# EAGLE design Daisy_Test (EAGLE 9.7.0)
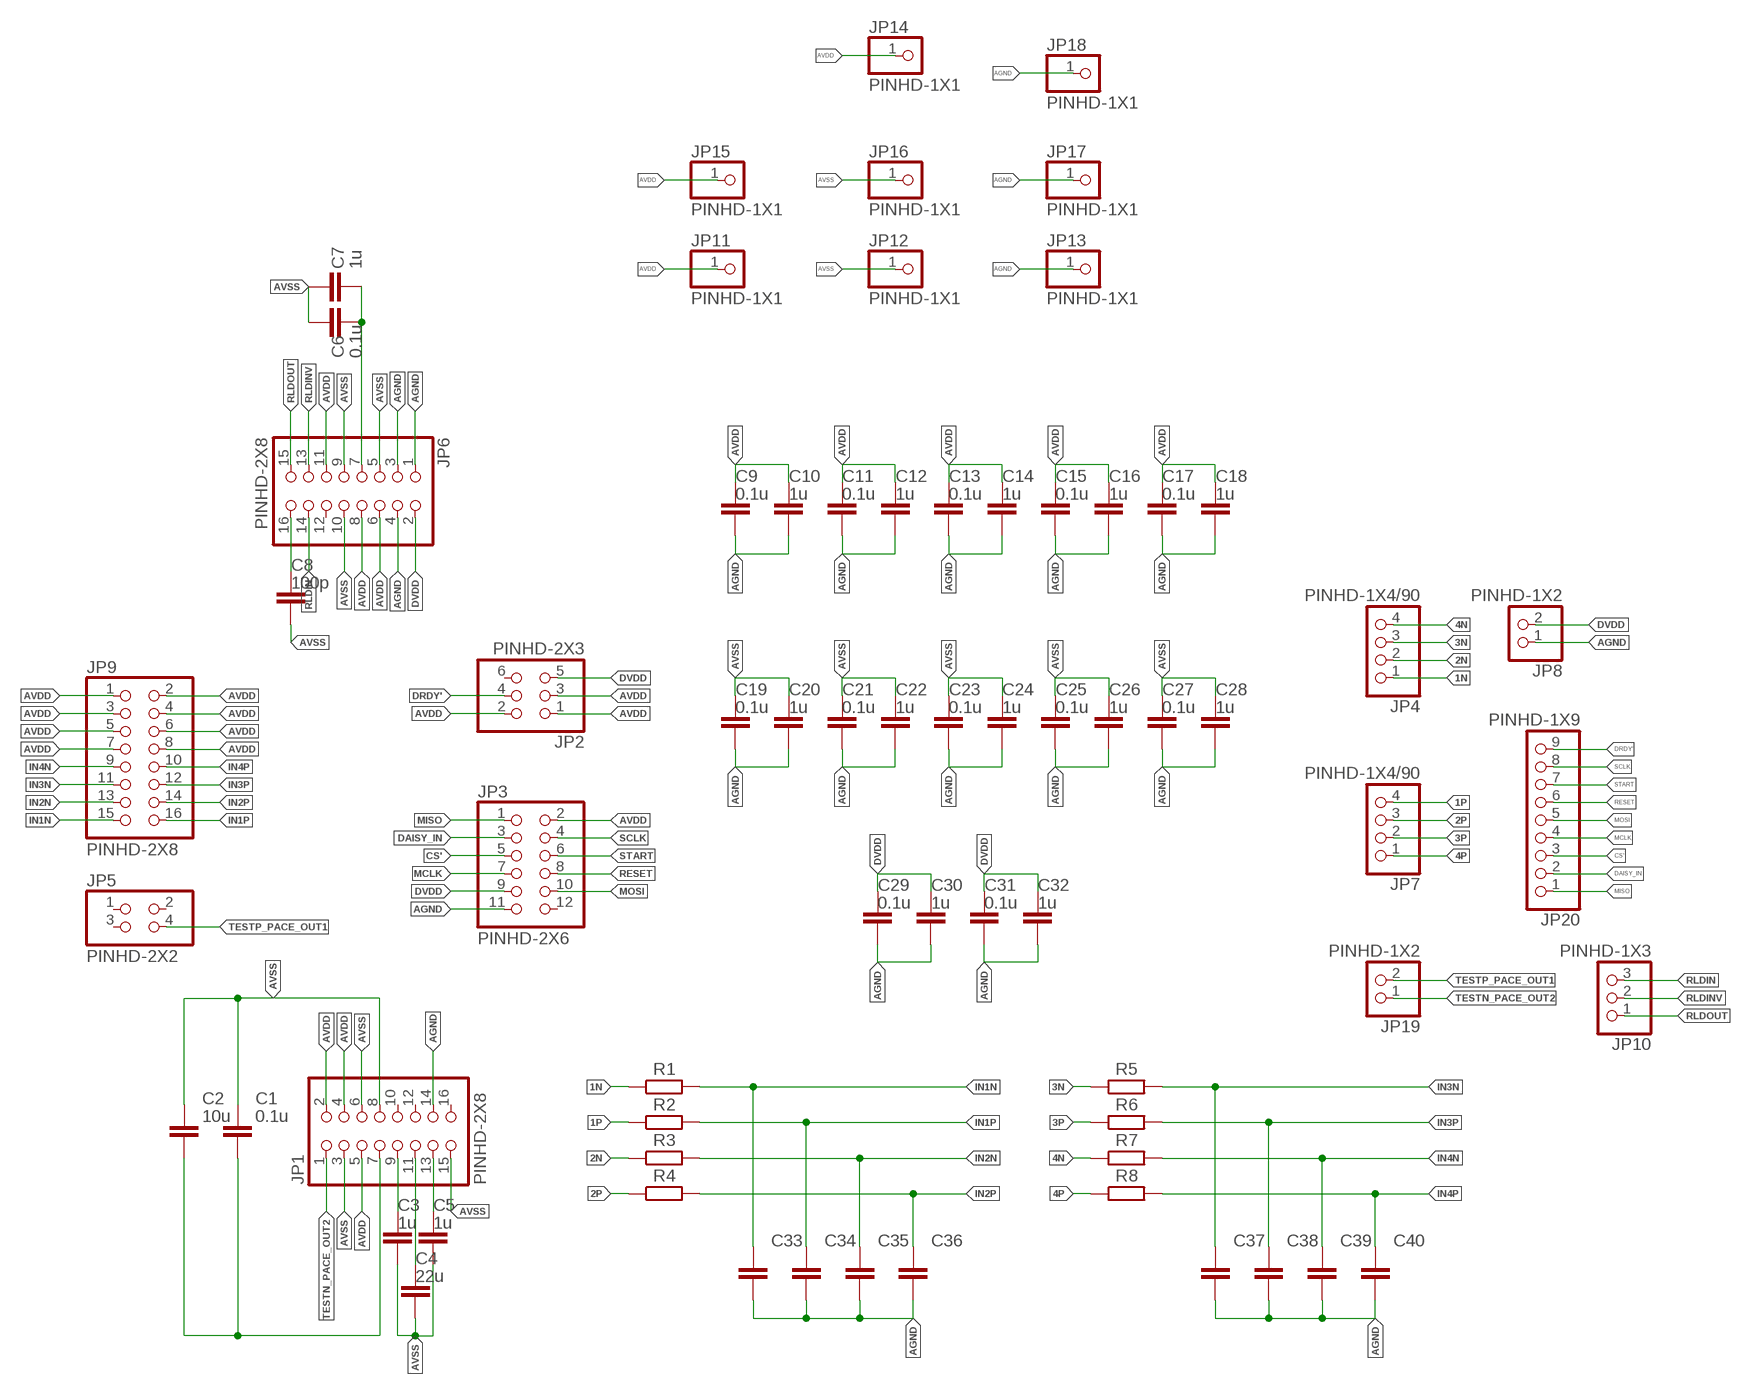
[diagram p0: schematic, sheet 1]

## Parts
C1  0.1u  C_CHIP-0805(2012-METRIC)  [CAPC2012X110]
C2  10u  C_CHIP-0805(2012-METRIC)  [CAPC2012X110]
C3  1u  C_CHIP-0805(2012-METRIC)  [CAPC2012X110]
C4  22u  C_CHIP-0805(2012-METRIC)  [CAPC2012X110]
C5  1u  C_CHIP-0805(2012-METRIC)  [CAPC2012X110]
C6  0.1u  C_CHIP-0805(2012-METRIC)  [CAPC2012X110]
C7  1u  C_CHIP-0805(2012-METRIC)  [CAPC2012X110]
C8  100p  C_CHIP-0805(2012-METRIC)  [CAPC2012X110]
C9  0.1u  C_CHIP-0805(2012-METRIC)  [CAPC2012X110]
C10  1u  C_CHIP-0805(2012-METRIC)  [CAPC2012X110]
C11  0.1u  C_CHIP-0805(2012-METRIC)  [CAPC2012X110]
C12  1u  C_CHIP-0805(2012-METRIC)  [CAPC2012X110]
C13  0.1u  C_CHIP-0805(2012-METRIC)  [CAPC2012X110]
C14  1u  C_CHIP-0805(2012-METRIC)  [CAPC2012X110]
C15  0.1u  C_CHIP-0805(2012-METRIC)  [CAPC2012X110]
C16  1u  C_CHIP-0805(2012-METRIC)  [CAPC2012X110]
C17  0.1u  C_CHIP-0805(2012-METRIC)  [CAPC2012X110]
C18  1u  C_CHIP-0805(2012-METRIC)  [CAPC2012X110]
C19  0.1u  C_CHIP-0805(2012-METRIC)  [CAPC2012X110]
C20  1u  C_CHIP-0805(2012-METRIC)  [CAPC2012X110]
C21  0.1u  C_CHIP-0805(2012-METRIC)  [CAPC2012X110]
C22  1u  C_CHIP-0805(2012-METRIC)  [CAPC2012X110]
C23  0.1u  C_CHIP-0805(2012-METRIC)  [CAPC2012X110]
C24  1u  C_CHIP-0805(2012-METRIC)  [CAPC2012X110]
C25  0.1u  C_CHIP-0805(2012-METRIC)  [CAPC2012X110]
C26  1u  C_CHIP-0805(2012-METRIC)  [CAPC2012X110]
C27  0.1u  C_CHIP-0805(2012-METRIC)  [CAPC2012X110]
C28  1u  C_CHIP-0805(2012-METRIC)  [CAPC2012X110]
C29  0.1u  C_CHIP-0805(2012-METRIC)  [CAPC2012X110]
C30  1u  C_CHIP-0805(2012-METRIC)  [CAPC2012X110]
C31  0.1u  C_CHIP-0805(2012-METRIC)  [CAPC2012X110]
C32  1u  C_CHIP-0805(2012-METRIC)  [CAPC2012X110]
C33  C_CHIP-0805(2012-METRIC)  [CAPC2012X110]
C34  C_CHIP-0805(2012-METRIC)  [CAPC2012X110]
C35  C_CHIP-0805(2012-METRIC)  [CAPC2012X110]
C36  C_CHIP-0805(2012-METRIC)  [CAPC2012X110]
C37  C_CHIP-0805(2012-METRIC)  [CAPC2012X110]
C38  C_CHIP-0805(2012-METRIC)  [CAPC2012X110]
C39  C_CHIP-0805(2012-METRIC)  [CAPC2012X110]
C40  C_CHIP-0805(2012-METRIC)  [CAPC2012X110]
JP1  PINHD-2X8  [2X08]
JP2  PINHD-2X3  [2X03]
JP3  PINHD-2X6  [2X06]
JP4  PINHD-1X4/90  [1X04/90]
JP5  PINHD-2X2  [2X02]
JP6  PINHD-2X8  [2X08]
JP7  PINHD-1X4/90  [1X04/90]
JP8  PINHD-1X2  [1X02]
JP9  PINHD-2X8  [2X08]
JP10  PINHD-1X3  [1X03]
JP11  PINHD-1X1  [1X01]
JP12  PINHD-1X1  [1X01]
JP13  PINHD-1X1  [1X01]
JP14  PINHD-1X1  [1X01]
JP15  PINHD-1X1  [1X01]
JP16  PINHD-1X1  [1X01]
JP17  PINHD-1X1  [1X01]
JP18  PINHD-1X1  [1X01]
JP19  PINHD-1X2  [1X02]
JP20  PINHD-1X9  [1X09]
R1  R_CHIP-1206(3216-METRIC)  [RESC3216X70]
R2  R_CHIP-1206(3216-METRIC)  [RESC3216X70]
R3  R_CHIP-1206(3216-METRIC)  [RESC3216X70]
R4  R_CHIP-1206(3216-METRIC)  [RESC3216X70]
R5  R_CHIP-1206(3216-METRIC)  [RESC3216X70]
R6  R_CHIP-1206(3216-METRIC)  [RESC3216X70]
R7  R_CHIP-1206(3216-METRIC)  [RESC3216X70]
R8  R_CHIP-1206(3216-METRIC)  [RESC3216X70]

## Nets
1N: JP4.1 R1.1
1P: JP7.4 R2.1
2N: JP4.2 R3.1
2P: JP7.3 R4.1
3N: JP4.3 R5.1
3P: JP7.2 R6.1
4N: JP4.4 R7.1
4P: JP7.1 R8.1
AGND: C9.2 C10.2 C11.2 C12.2 C13.2 C14.2 C15.2 C16.2 C17.2 C18.2 C19.2 C20.2 C21.2 C22.2 C23.2 C24.2 C25.2 C26.2 C27.2 C28.2 C29.2 C30.2 C31.2 C32.2 C33.2 C34.2 C35.2 C36.2 C37.2 C38.2 C39.2 C40.2 JP1.14 JP3.11 JP6.1 JP6.3 JP6.4 JP8.1 JP13.1 JP17.1 JP18.1
AVDD: C9.1 C10.1 C11.1 C12.1 C13.1 C14.1 C15.1 C16.1 C17.1 C18.1 JP1.2 JP1.4 JP1.5 JP2.1 JP2.2 JP2.3 JP3.2 JP6.6 JP6.8 JP6.11 JP9.1 JP9.2 JP9.3 JP9.4 JP9.5 JP9.6 JP9.7 JP9.8 JP11.1 JP14.1 JP15.1
AVSS: C1.1 C2.1 C3.2 C4.2 C5.2 C6.1 C7.1 C8.2 C19.1 C20.1 C21.1 C22.1 C23.1 C24.1 C25.1 C26.1 C27.1 C28.1 JP1.3 JP1.6 JP1.8 JP1.15 JP6.5 JP6.9 JP6.10 JP12.1 JP16.1
CS': JP3.5 JP20.3
DAISY_IN: JP3.3 JP20.2
DRDY': JP2.4 JP20.9
DVDD: C29.1 C30.1 C31.1 C32.1 JP2.5 JP3.9 JP6.2 JP8.2
IN1N: C33.1 JP9.15 R1.2
IN1P: C34.1 JP9.16 R2.2
IN2N: C35.1 JP9.13 R3.2
IN2P: C36.1 JP9.14 R4.2
IN3N: C37.1 JP9.11 R5.2
IN3P: C38.1 JP9.12 R6.2
IN4N: C39.1 JP9.9 R7.2
IN4P: C40.1 JP9.10 R8.2
MCLK: JP3.7 JP20.4
MISO: JP3.1 JP20.1
MOSI: JP3.10 JP20.5
N$1: C3.1 JP1.9
N$3: C4.1 JP1.11
N$4: C5.1 JP1.13
N$5: C6.2 C7.2 JP6.7
N$6: C8.1 JP6.16
N$7: C1.2 C2.2 JP1.7
RESET: JP3.8 JP20.6
RLDIN: JP6.14 JP10.3
RLDINV: JP6.13 JP10.2
RLDOUT: JP6.15 JP10.1
SCLK: JP3.4 JP20.8
START: JP3.6 JP20.7
TESTN_PACE_OUT2: JP1.1 JP19.1
TESTP_PACE_OUT1: JP5.4 JP19.2
Unconnected: JP1.10 JP1.12 JP1.16 JP2.6 JP3.12 JP5.1 JP5.2 JP5.3 JP6.12

## Library data of the parts
C1-C40 = Capacitor:C: Capacitor - Generic; CATEGORY: Capacitor
JP1 JP6 JP9 = Connector:PINHD-2X8: PIN HEADER; CATEGORY: CONNECTOR; SUB-CATEGORY: PIN-HEADER
JP2 = Connector:PINHD-2X3: PIN HEADER; CATEGORY: CONNECTOR; SUB-CATEGORY: PIN-HEADER
JP3 = Connector:PINHD-2X6: PIN HEADER; CATEGORY: CONNECTOR; SUB-CATEGORY: PIN-HEADER
JP4 JP7 = Connector:PINHD-1X4: PIN HEADER; CATEGORY: CONNECTOR; SUB-CATEGORY: PIN-HEADER
JP5 = Connector:PINHD-2X2: PIN HEADER; CATEGORY: CONNECTOR; SUB-CATEGORY: PIN-HEADER
JP8 JP19 = Connector:PINHD-1X2: PIN HEADER; CATEGORY: CONNECTOR; SUB-CATEGORY: PIN-HEADER
JP10 = Connector:PINHD-1X3: PIN HEADER; CATEGORY: CONNECTOR; SUB-CATEGORY: PIN-HEADER
JP11-JP18 = Connector:PINHD-1X1: PIN HEADER; CATEGORY: CONNECTOR; SUB-CATEGORY: PIN-HEADER
JP20 = Connector:PINHD-1X9: PIN HEADER; CATEGORY: CONNECTOR; SUB-CATEGORY: PIN-HEADER
R1-R8 = Resistor:R: Resistor Fixed - Generic; CATEGORY: Resistor; SUB-CATEGORY: Fixed

## Board
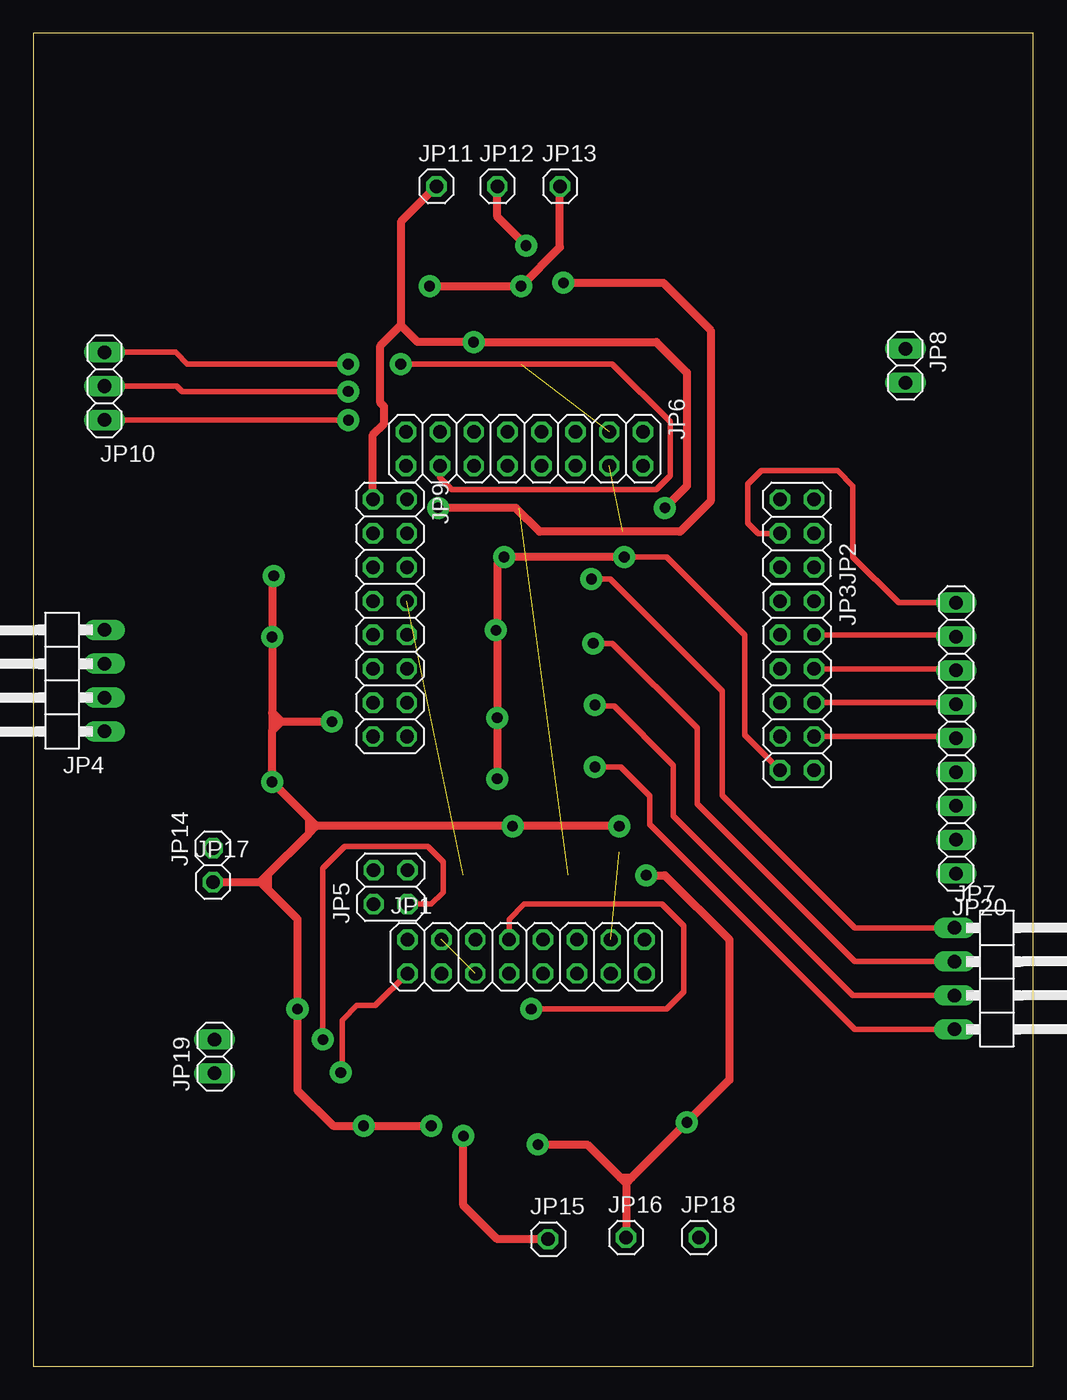
[diagram p1: board, top side]
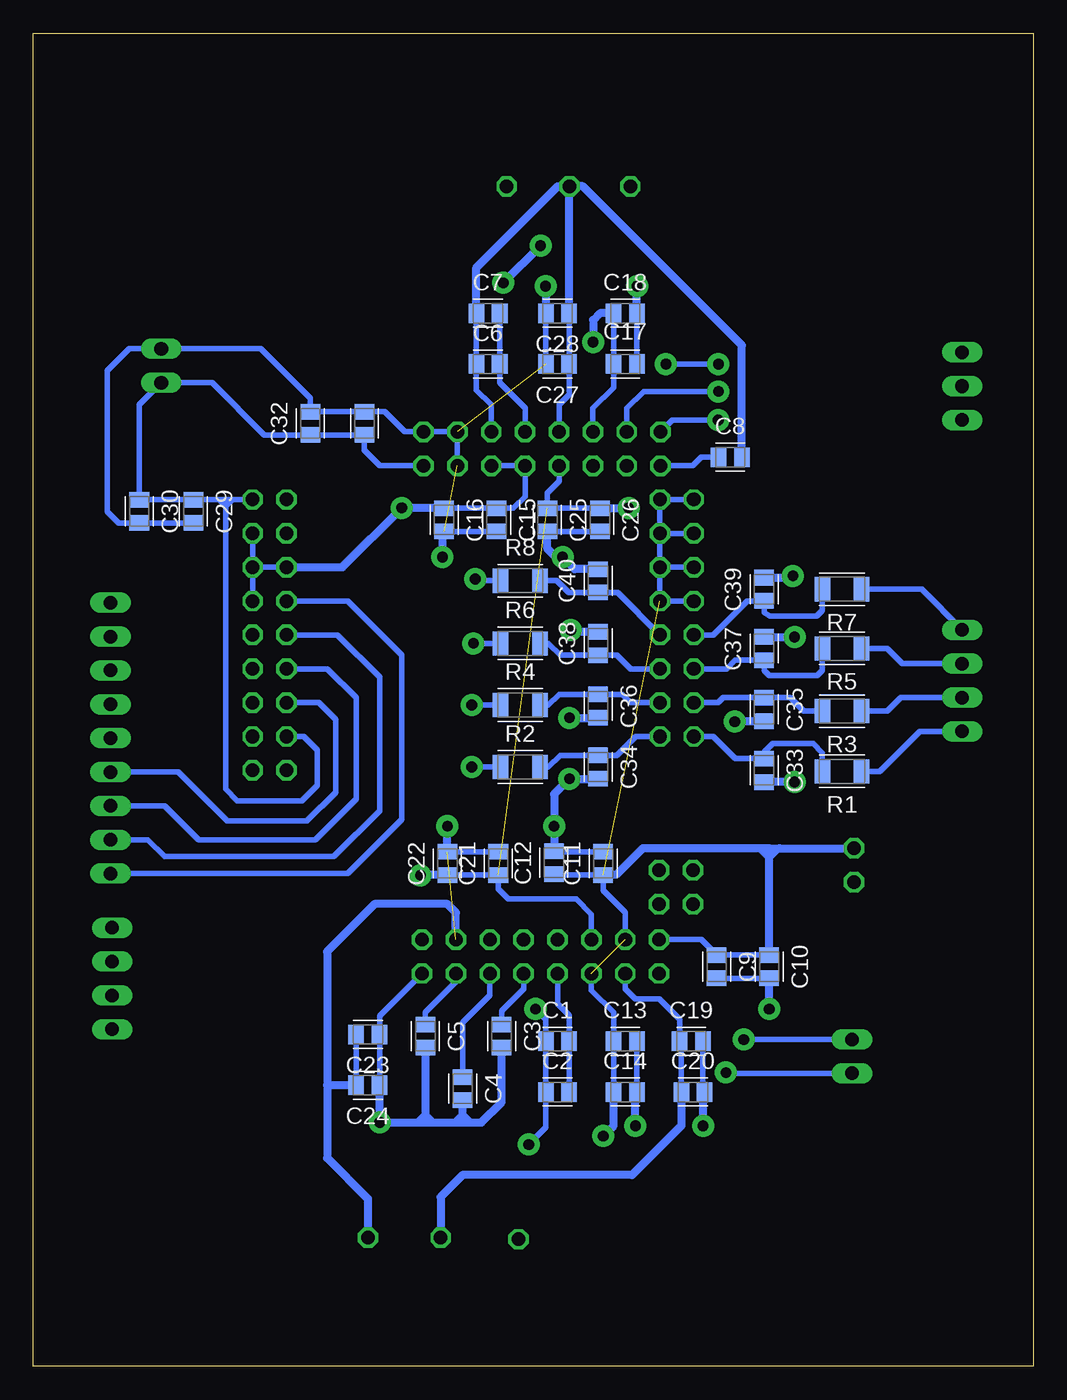
[diagram p2: board, bottom side, seen from below]

Size 75 x 100 mm. Coordinates in mm from the lower left corner, seen from the top.
Outline: 0,0 75,0 75,100 0,100 0,0
Copper layers (1*16): Top 0.035mm / dielectric 1.5mm / Bottom 0.035mm
Design rules "default *": minimum track width 16mil, minimum drill 0.7mm, track to track 16mil, track to pad 16mil, pad to pad 16mil, via to via 16mil, smd to smd 16mil, copper to edge 40mil, drill to drill 16mil, minimum pad ring 10mil, minimum via ring 8mil, stop-mask expansion 4mil, vias tented up to drill 0mil, thermal gap 10mil

### Footprints (pad centres in the part's own frame; a part is rotated, then mirrored left to right if it is on the bottom)
CAPC2012X110 = smd 1.165 x 1.465: 1 -0.875,0; 2 0.875,0
2X08 = drill 1.016 octagon: 1 -8.89,-1.27; 2 -8.89,1.27; 3 -6.35,-1.27; 4 -6.35,1.27; 5 -3.81,-1.27; 6 -3.81,1.27; 7 -1.27,-1.27; 8 -1.27,1.27; 9 1.27,-1.27; 10 1.27,1.27; 11 3.81,-1.27; 12 3.81,1.27; 13 6.35,-1.27; 14 6.35,1.27; 15 8.89,-1.27; 16 8.89,1.27
2X03 = drill 1.016 octagon: 1 -2.54,-1.27; 2 -2.54,1.27; 3 0,-1.27; 4 0,1.27; 5 2.54,-1.27; 6 2.54,1.27
2X06 = drill 1.016 octagon: 1 -6.35,-1.27; 2 -6.35,1.27; 3 -3.81,-1.27; 4 -3.81,1.27; 5 -1.27,-1.27; 6 -1.27,1.27; 7 1.27,-1.27; 8 1.27,1.27; 9 3.81,-1.27; 10 3.81,1.27; 11 6.35,-1.27; 12 6.35,1.27
1X04/90 = drill 1.016 long: 1 -3.81,-3.81; 2 -1.27,-3.81; 3 1.27,-3.81; 4 3.81,-3.81
2X02 = drill 1.016 octagon: 1 -1.27,-1.27; 2 -1.27,1.27; 3 1.27,-1.27; 4 1.27,1.27
1X02 = drill 1.016 long: 1 -1.27,0; 2 1.27,0
1X03 = drill 1.016 long: 1 -2.54,0; 2 0,0; 3 2.54,0
1X01 = drill 1.016 octagon: 1 0,0
1X09 = drill 1.016 long: 1 -10.16,0; 2 -7.62,0; 3 -5.08,0; 4 -2.54,0; 5 0,0; 6 2.54,0; 7 5.08,0; 8 7.62,0; 9 10.16,0
RESC3216X70 = smd 1.165 x 1.815: 1 -1.475,0; 2 1.475,0

### Placement (x,y rotation side)
C1  35.69,24.38 0 bottom
C2  35.69,20.57 0 bottom
C3  39.88,24.77 270 bottom
C4  42.8,20.83 270 bottom
C5  45.59,24.77 270 bottom
C6  40.89,75.18 0 bottom
C7  40.89,78.99 0 bottom
C8  22.73,68.2 0 bottom
C9  23.75,29.97 270 bottom
C10  19.81,29.97 270 bottom
C11  32.26,37.72 90 bottom
C12  35.95,37.78 90 bottom
C13  30.61,24.38 0 bottom
C14  30.61,20.57 0 bottom
C15  40.26,63.5 270 bottom
C16  44.2,63.5 270 bottom
C17  30.61,75.18 0 bottom
C18  30.61,78.99 0 bottom
C19  25.65,24.38 0 bottom
C20  25.53,20.57 0 bottom
C21  40.13,37.72 90 bottom
C22  43.94,37.72 90 bottom
C23  49.91,24.89 180 bottom
C24  49.91,21.08 180 bottom
C25  36.45,63.5 270 bottom
C26  32.51,63.5 270 bottom
C27  35.69,75.18 180 bottom
C28  35.69,78.99 180 bottom
C29  62.99,64.14 270 bottom
C30  67.06,64.14 270 bottom
C31  50.16,70.74 90 bottom
C32  54.23,70.74 90 bottom
C33  20.19,44.7 270 bottom
C34  32.64,44.96 270 bottom
C35  20.19,49.28 270 bottom
C36  32.64,49.53 270 bottom
C37  20.19,53.85 90 bottom
C38  32.64,54.23 90 bottom
C39  20.19,58.29 90 bottom
C40  32.64,58.93 90 bottom
JP1  36.96,30.73 0 top
JP2  57.28,62.48 90 top
JP3  57.28,51.05 270 top
JP4  1.52,51.44 90 top
JP5  26.8,35.94 270 top
JP6  36.84,68.83 180 top
JP7  72.9,29.08 270 top
JP8  65.41,75.06 270 top
JP9  26.74,56.13 270 top
JP10  5.33,73.53 90 top
JP11  30.23,88.52 0 top
JP12  34.8,88.52 0 top
JP13  39.5,88.52 0 top
JP14  13.46,38.86 90 top
JP15  38.61,9.53 0 top
JP16  44.45,9.65 0 top
JP17  13.46,36.32 0 top
JP18  49.91,9.65 0 top
JP19  13.59,23.24 90 top
JP20  69.22,47.12 90 top
R1  14.35,44.63 180 bottom
R2  38.48,44.96 0 bottom
R3  14.35,49.15 180 bottom
R4  38.48,49.61 0 bottom
R5  14.35,53.85 180 bottom
R6  38.48,54.23 0 bottom
R7  14.35,58.29 180 bottom
R8  38.48,58.93 0 bottom

### Tracks (layer width: path | path; a pad name or v marks a point on that pad's centre or on a via)
1N
  Bottom 0.406: JP4.1 8.51,47.62 11.51,44.63 R1.1
1P  (via drill 0.8 pad 1.65)
  Top 0.406: JP7.4 61.59,25.27 46.23,40.64 46.23,42.8 44.07,44.96 v42.12,44.96
  Bottom 0.406: v42.12,44.96 R2.1
2N
  Bottom 0.406: JP4.2 9.96,50.16 10.97,49.15 R3.1
2P  (via drill 0.8 pad 1.65)
  Top 0.406: JP7.3 61.47,27.81 48.01,41.27 48.01,45.09 43.56,49.53 42.12,49.53 v42.12,49.61
  Bottom 0.406: v42.12,49.61 R4.1
3N
  Bottom 0.406: JP4.3 9.83,52.7 10.97,53.85 R5.1
3P  (via drill 0.8 pad 1.65)
  Top 0.406: JP7.2 61.59,30.35 49.78,42.16 49.78,47.88 43.43,54.23 v41.99,54.23
  Bottom 0.406: v41.99,54.23 R6.1
4N
  Bottom 0.406: JP4.4 8.38,58.29 R7.1
4P  (via drill 0.8 pad 1.65)
  Top 0.406: v41.86,59.05 43.26,59.05 51.66,50.65 51.66,42.82 61.59,32.89 JP7.1
  Bottom 0.406: v41.86,59.05 41.73,58.93 R8.1
AGND  (via drill 0.8 pad 1.65)  (3 unrouted)
  Top 0.406: v44.32,60.71 47.5,60.71 53.34,54.86 53.34,47.37 JP3.11
  Top 0.61: v18.03,59.3 17.91,59.17 v17.91,54.71 17.91,49.04 | 17.91,49.04 17.91,47.68 | 17.91,47.68 v17.91,43.83 20.64,41.09 | v44.32,60.71 v35.31,60.71 34.8,60.2 34.8,55.12 | 34.8,55.12 v34.8,48.64 v34.8,44.07 | v43.94,40.51 v35.94,40.51 21.22,40.51 | 21.22,40.51 20.64,41.09 | v29.72,81.03 v36.58,81.03 39.5,83.95 JP13.1 | JP17.1 17.03,36.32 | 17.03,36.32 17.6,36.89 | 17.6,36.89 20.64,39.94 | 20.64,39.94 21.22,40.51 | 17.03,36.32 17.6,35.76 | 17.6,35.76 19.81,33.54 v19.81,26.8 19.81,20.7 22.48,18.03 v24.77,18.03 v29.84,18.03 | 18.59,48.36 v22.4,48.36 | 17.91,49.04 18.59,48.36 | 17.91,47.68 18.59,48.36 | 34.8,55.12 v34.7,55.22 | 20.64,41.09 20.64,39.94 | 17.6,36.89 17.6,35.76
  Bottom 0.406: C31.2 49.92,71.37 | C31.2 48.65,71.61 47.13,70.1 JP6.1 JP6.3 JP6.4 | C31.2 C32.2 54.23,72.63 57.93,76.33 JP8.1 67.82,76.33 69.47,74.68 69.47,64.14 68.59,63.26 C30.2 C29.2 | C13.2 C14.2 | C19.2 24.78,20.7 C20.2 | C23.2 C24.2 | C10.2 C9.2 | C11.2 35.9,38.59 C12.2 | C21.2 C22.2 | C18.2 C17.2 | C28.2 C27.2 | C25.2 C26.2 | C15.2 C16.2
  Bottom 0.61: C39.2 18.16,59.17 v18.03,59.3 | v17.91,43.83 C33.2 | C16.2 44.32,62.5 v44.32,60.71 | C25.2 36.45,61.34 35.81,60.71 v35.31,60.71 34.4,59.8 C40.2 | v34.8,48.64 32.65,48.64 C36.2 | C34.2 32.65,44.07 v34.8,44.07 35.94,42.93 v35.94,40.51 C12.2 35.9,38.59 | C22.2 v43.94,40.51 | C18.2 29.73,81.01 v29.72,81.03 | v36.58,81.03 36.58,79.01 C28.2 | v19.81,26.8 C10.2 | 24.78,20.7 24.78,18.05 v24.77,18.03 | v29.84,18.03 29.84,20.46 C14.2 | JP1.14 43.31,34.04 43.94,34.67 49.4,34.67 52.96,31.11 52.96,21.08 | C24.2 52.96,21.08 | 52.96,21.08 52.96,15.62 49.91,12.57 JP18.1 | C37.2 17.92,54.72 v17.91,54.71 | v22.4,48.36 22.35,48.4 C35.2 | v34.7,55.22 34.58,55.1 C38.2
AVDD  (via drill 0.8 pad 1.65)  (2 unrouted)
  Top 0.61: v47.37,64.39 49.02,66.04 49.02,74.55 46.74,76.83 v33.02,76.83 28.83,76.83 27.56,78.11 | JP11.1 27.56,85.85 27.56,78.11 | JP15.1 34.8,9.53 32.26,12.06 v32.26,17.27 | JP9.1 25.47,69.89 26.31,70.73 26.31,72 26.02,72.28 26.02,76.57 27.56,78.11
  Bottom 0.406: JP1.4 30.61,34.05 32.26,35.7 C11.1 | 32.12,36.71 C11.1 | C11.1 35.9,36.84 C12.1 | JP1.2 24.91,32 C9.1 C10.1 | JP9.1 JP9.2 JP9.4 | JP9.3 JP9.4 | JP9.5 JP9.6 | JP9.7 JP9.8 JP9.6 | JP6.11 33.03,71.88 31.48,73.43 C17.1 C18.1 | C16.1 C15.1 38.99,64.38 38.11,65.25 JP6.8 JP6.6 | C14.1 C13.1 31.48,26.53 33.15,28.19 JP1.5 | JP9.4 JP9.6 | JP2.3 JP2.1 | JP2.1 JP2.2 | JP3.2 JP2.1 | 20.57,38.86 19.81,38.1 19.05,38.86
  Bottom 0.61: C16.1 47.36,64.38 v47.37,64.39 51.82,59.94 JP2.2 | C18.1 32.51,78.99 33.02,78.49 v33.02,76.83 | v32.26,17.27 31.48,18.05 C14.1 | 19.81,38.86 19.05,38.86 JP14.1 | 19.81,38.86 19.81,38.1 C10.1 | 19.81,38.86 20.57,38.86 29.29,38.86 31.29,36.86 32.24,36.86 C11.1
AVSS  (via drill 0.8 pad 1.65)  (1 unrouted)
  Top 0.406: JP1.15 | JP1.8 35.69,33.53 36.83,34.67 47.12,34.67 48.77,33.02 48.77,28.07 47.5,26.8 v37.34,26.8
  Top 0.61: v45.97,36.83 47.37,36.83 52.2,32 52.2,21.46 v49.02,18.29 44.9,14.16 | 44.9,14.16 44.45,13.72 | 44.45,13.72 JP16.1 | v30.35,64.39 36.2,64.39 37.97,62.61 48.51,62.61 50.8,64.9 50.8,77.72 47.24,81.28 v39.75,81.28 | v36.96,84.07 34.8,86.23 JP12.1 | v37.85,16.64 41.53,16.64 44.01,14.16 | 44.01,14.16 44.45,13.72 | 44.01,14.16 44.9,14.16
  Bottom 0.406: C20.1 26.4,24.26 C19.1 26.53,26.02 28.07,27.56 29.84,27.56 30.61,28.32 JP1.3 | C26.1 C25.1 36.45,65.52 35.57,66.39 JP6.10 | C28.1 C27.1 34.81,72.89 35.57,72.13 JP6.9 | C7.1 C6.1 41.77,73.25 40.65,72.13 JP6.5 | C22.1 C21.1 40.13,35.81 39.37,35.05 34.29,35.05 33.15,33.91 JP1.6 | JP1.15 49.04,26.27 C23.1 C24.1 | C2.1 C1.1 36.56,26.02 v37.34,26.8 | C2.1 36.53,20.54 | 42.16,18.29 42.8,18.92 43.43,18.29 | 44.96,18.29 45.47,18.8 45.59,18.8 | 46.23,18.29 45.59,18.92 45.59,19.18 | C2.1 36.56,17.92 v37.85,16.64
  Bottom 0.61: C28.1 34.8,79.01 JP12.1 | C7.1 41.77,82.44 35.69,88.52 JP12.1 | C8.2 21.86,76.59 33.78,88.52 JP12.1 | C22.1 45.96,36.84 v45.97,36.83 | C24.1 49.02,21.07 v49.02,18.29 46.23,18.29 45.47,18.29 | 45.47,18.29 44.96,18.29 43.43,18.29 42.94,18.29 | 42.94,18.29 42.16,18.29 41.4,18.29 39.88,19.81 C3.2 | 42.94,18.29 42.8,18.43 42.8,18.92 C4.2 | C5.2 45.59,19.18 45.59,18.8 45.59,18.41 45.47,18.29 | C20.1 26.4,18.05 30.1,14.35 42.8,14.35 44.45,12.7 JP16.1 | C26.1 30.37,64.38 v30.35,64.39 | v39.75,81.28 v36.96,84.07
CS'
  Bottom 0.406: JP3.5 52.96,52.32 50.8,50.16 50.8,42.55 53.85,39.5 62.61,39.5 65.15,42.04 JP20.3
DAISY_IN
  Bottom 0.406: JP3.3 52.2,54.86 49.02,51.69 49.02,41.66 52.45,38.23 65.15,38.23 66.42,39.5 JP20.2
DRDY'
  Top 0.406: JP2.4 54.36,62.48 53.59,63.25 53.59,66.17 54.61,67.18 60.33,67.18 61.47,66.04 61.47,60.71 64.9,57.28 JP20.9
DVDD
  Bottom 0.406: JP6.2 49,67.56 50.16,68.72 C31.1 C32.1 57.67,69.86 61.59,73.79 JP8.2 67.06,72.14 C30.1 C29.1 61.07,65.01 | 61.07,65.01 60.58,65.01 | 60.58,65.01 60.09,65.01 | 60.09,65.01 JP2.5 | JP3.9 54.74,47.24 53.72,46.23 53.72,43.56 54.86,42.42 59.69,42.42 60.58,43.31 60.58,64.52 | 60.58,64.52 60.58,65.01 | 60.09,65.01 60.58,64.52 | 61.07,65.01 60.58,64.52
IN1N
  Bottom 0.406: JP9.15 24.02,47.24 22.35,45.58 C33.1 20.19,46.09 19.56,46.72 16.52,46.72 15.83,46.02 R1.2
IN1P
  Bottom 0.406: JP9.16 29.83,47.24 31.24,45.83 C34.1 35.49,45.83 36.37,44.96 R2.2
IN2N
  Bottom 0.406: R3.2 17.22,49.15 18.23,50.15 C35.1 23.27,50.15 23.63,49.78 JP9.13
IN2P
  Bottom 0.406: JP9.14 30.19,49.78 30.82,50.41 C36.1 35.57,50.41 36.37,49.61 R4.2
IN3N
  Bottom 0.406: JP9.11 23,52.32 22.35,52.97 C37.1 20.19,52.21 19.81,51.83 16.19,51.83 15.83,52.2 R5.2
IN3P
  Bottom 0.406: JP9.12 30.21,52.32 31.24,53.35 C38.1 35.49,53.35 36.37,54.23 R6.2
IN4N
  Bottom 0.406: JP9.9 24.02,54.86 21.46,57.42 C39.1 20.19,56.56 19.77,56.27 16.24,56.27 15.83,56.69 R7.2
IN4P
  Bottom 0.406: JP9.10 31.18,58.04 32.62,58.04 C40.1 34.86,58.05 35.74,58.93 R8.2
MCLK
  Bottom 0.406: JP3.7 53.59,49.78 52.32,48.51 52.32,43.05 54.48,40.89 60.45,40.89 64.14,44.58 JP20.4
MISO
  Bottom 0.406: JP3.1 51.44,57.4 47.37,53.34 47.37,41.02 51.44,36.96 JP20.1
MOSI
  Top 0.406: JP20.5 69.09,47.24 JP3.10
N$1
  Bottom 0.406: JP1.9 38.23,28.31 39.88,26.66 C3.1
N$3
  Bottom 0.406: JP1.11 40.77,27.81 42.8,25.78 C4.1
N$4
  Bottom 0.406: C5.1 45.59,26.53 43.31,28.82 JP1.13
N$5
  Bottom 0.406: C7.2 C6.2 40.02,73.79 38.11,71.88 JP6.7
N$6
  Bottom 0.406: C8.1 24.9,68.2 25.54,67.56 JP6.16
N$7
  Bottom 0.406: JP1.7 35.69,27.18 34.81,26.3 C1.2 C2.2
RESET
  Top 0.406: JP20.6 69.09,49.78 JP3.8
RLDIN  (via drill 0.8 pad 1.65)
  Top 0.406: JP6.14 30.49,66.66 31.37,65.79 46.74,65.79 47.75,66.8 47.75,70.87 43.43,75.18 v27.56,75.18 | v23.62,75.18 11.56,75.18 10.67,76.07 JP10.3
  Bottom 0.406: v27.56,75.18 v23.62,75.18
RLDINV  (via drill 0.8 pad 1.65)
  Top 0.406: v23.62,73.13 11.18,73.13 10.77,73.53 JP10.2
  Bottom 0.406: JP6.13 30.49,71.87 29.23,73.13 v23.62,73.13
RLDOUT  (via drill 0.8 pad 1.65)
  Top 0.406: v23.63,70.98 23.62,70.99 JP10.1
  Bottom 0.406: JP6.15 27.07,70.98 v23.63,70.98
SCLK
  Top 0.406: JP20.8 69.09,54.86 JP3.4
START
  Top 0.406: JP20.7 69.09,52.32 JP3.6
TESTN_PACE_OUT2  (via drill 0.8 pad 1.65)
  Top 0.406: JP1.1 25.65,27.05 24.26,27.05 23.15,25.95 23.15,22.13 v23.05,22.03
  Bottom 0.406: v23.05,22.03 22.99,21.97 JP19.1
TESTP_PACE_OUT1  (via drill 0.8 pad 1.65)
  Top 0.406: JP5.4 29.84,34.67 30.73,35.56 30.73,37.85 29.59,38.99 23.37,38.99 21.72,37.34 v21.72,24.51
  Bottom 0.406: JP19.2 v21.72,24.51